# Altium schematic sheet main.SchDoc
size A3
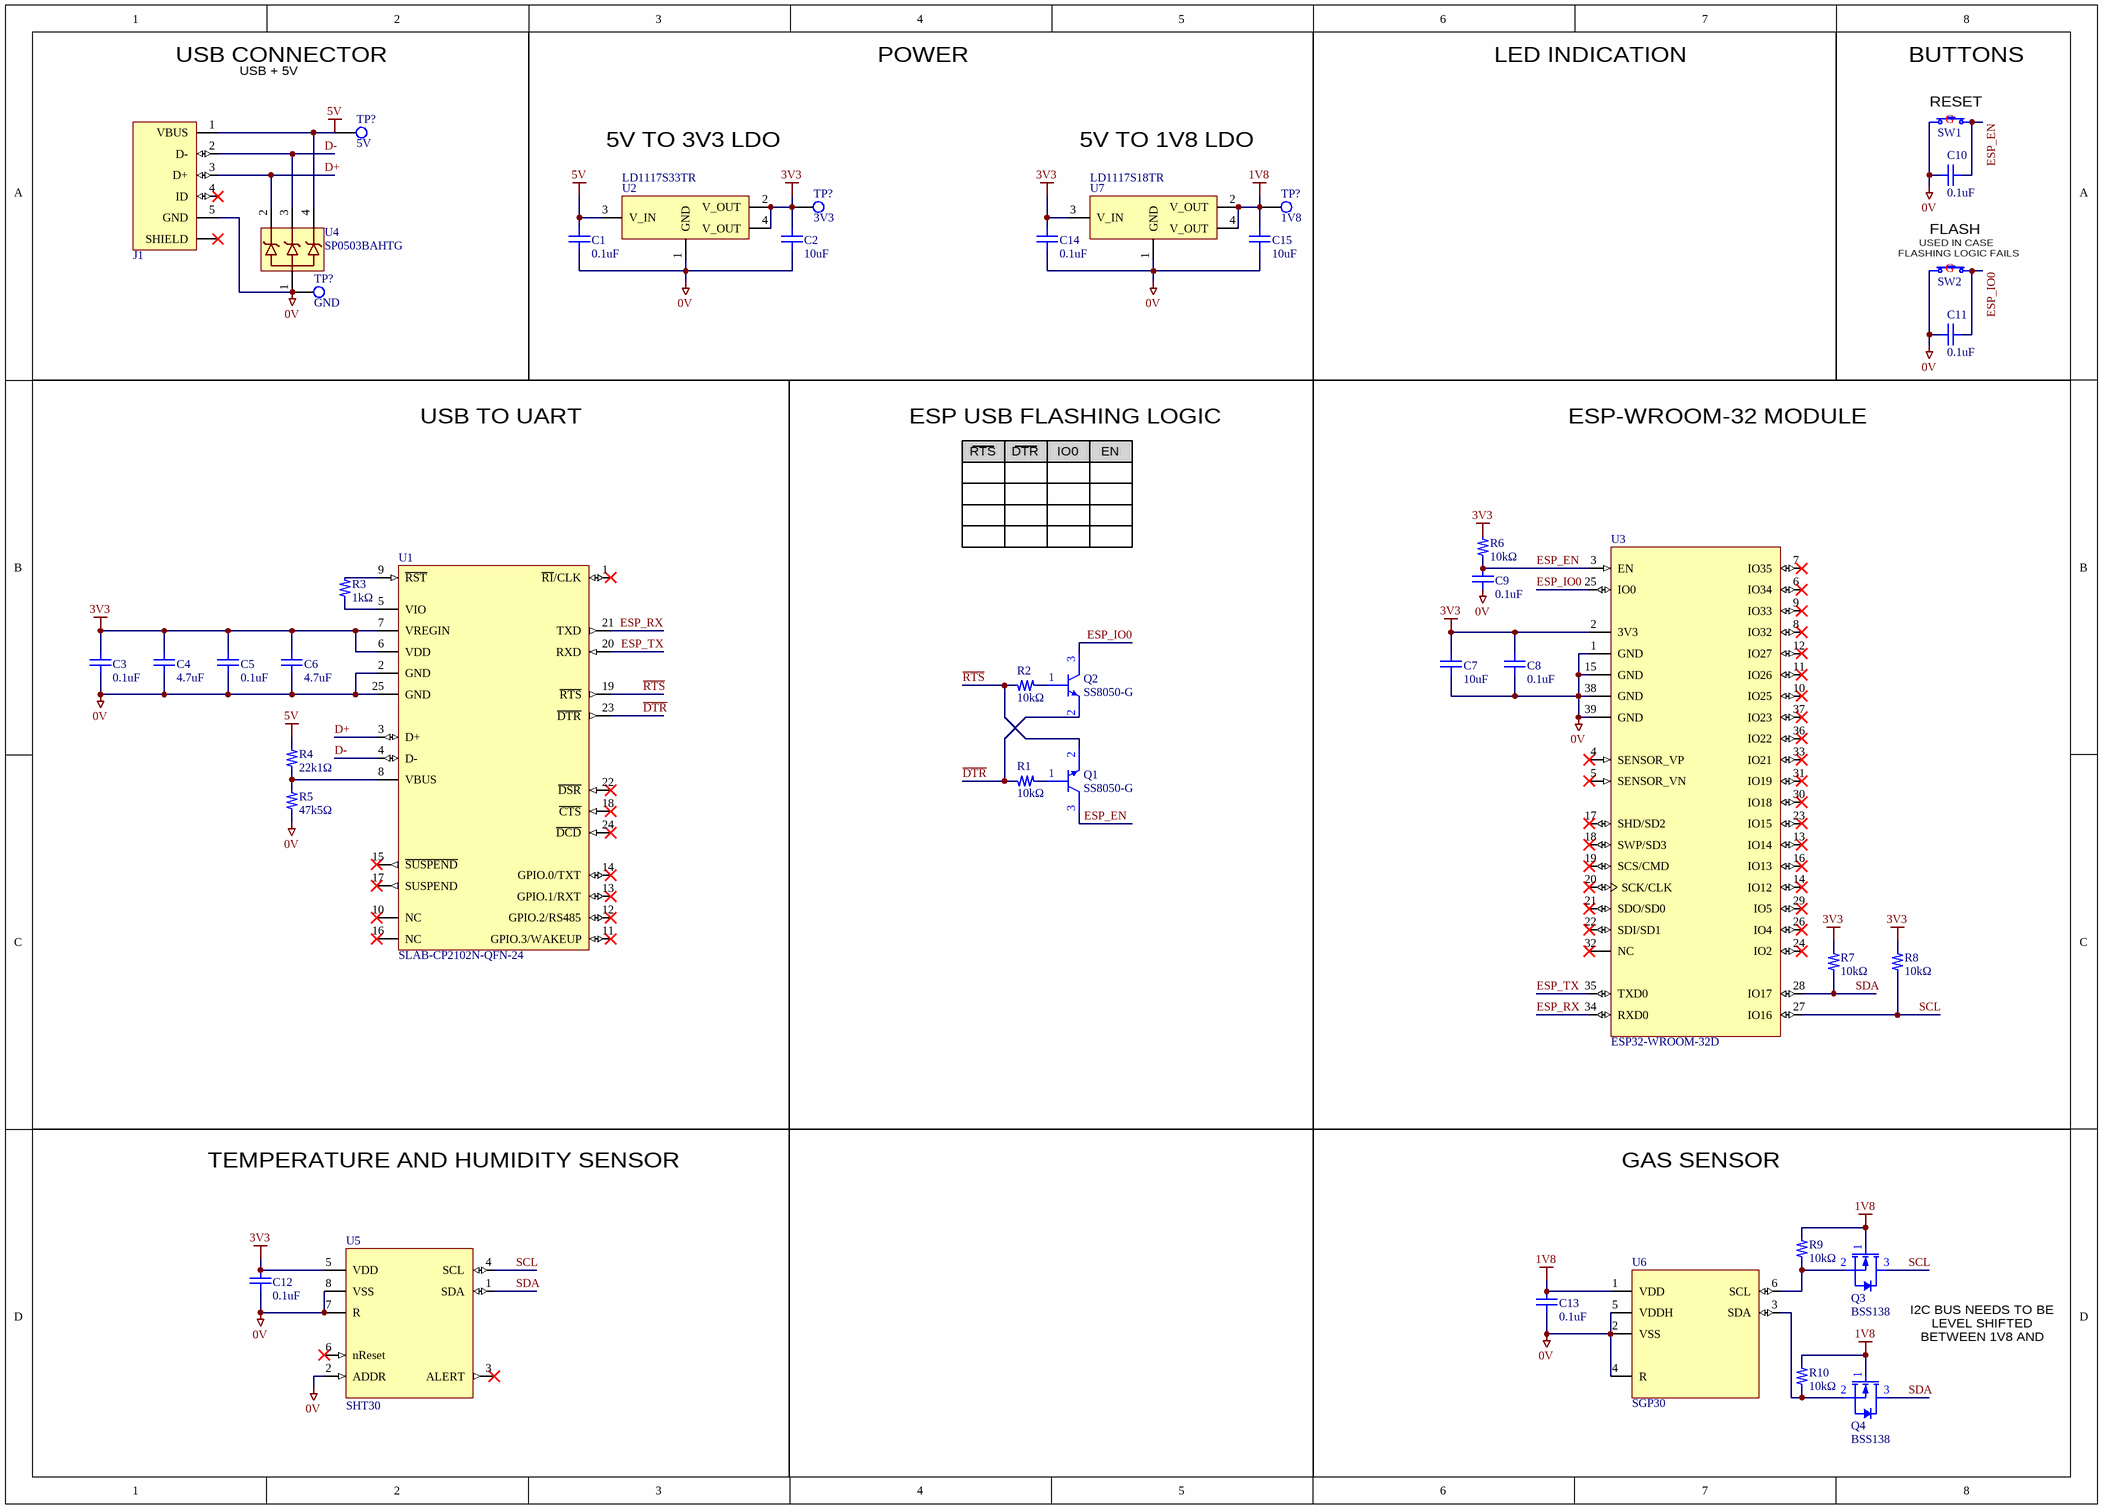
[diagram p0: main.SchDoc]

## Parts
(Parts that share a designator on the sheet are numbered #1, #2 ... from top to bottom, then left to right.)
C1  0.1uF  [CAP_0603]
C2  10uF  [CAP_0603]
C3  0.1uF  [CAP_0603]
C4  4.7uF  [CAP_0603]
C5  0.1uF  [CAP_0603]
C6  4.7uF  [CAP_0603]
C7  10uF  [CAP_0603]
C8  0.1uF  [CAP_0603]
C9  0.1uF  [CAP_0603]
C10  0.1uF  [CAP_0603]
C11  0.1uF  [CAP_0603]
C12  0.1uF  [CAP_0603]
C13  0.1uF  [CAP_0603]
C14  0.1uF  [CAP_0603]
C15  10uF  [CAP_0603]
J1  UJ2-MIBH2-4-SMT-TR  [CON_USB_MICRO_DRILL]  (value not drawn)
Q1  SS8050-G  [SOT-23]
Q2  SS8050-G  [SOT-23]
Q3  BSS138  [SOT-23]
Q4  BSS138  [SOT-23]
R1  10kΩ  [RES_0603_HD]
R2  10kΩ  [RES_0603_HD]
R3  1kΩ  [RES_0603_HD]
R4  22k1Ω  [RES_0603_HD]
R5  47k5Ω  [RES_0603_HD]
R6  10kΩ  [RES_0603_HD]
R7  10kΩ  [RES_0603_HD]
R8  10kΩ  [RES_0603_HD]
R9  10kΩ  [RES_0603_HD]
R10  10kΩ  [RES_0603_HD]
SW1  SW_PUSH_GENERIC  (value not drawn)
SW2  SW_PUSH_GENERIC  (value not drawn)
TP?#1  5V  [UTIL_Test_Point_3mm_1mmHole]
TP?#2  3V3  [UTIL_Test_Point_3mm_1mmHole]
TP?#3  1V8  [UTIL_Test_Point_3mm_1mmHole]
TP?#4  GND  [UTIL_Test_Point_3mm_1mmHole]
U1  SLAB-CP2102N-QFN-24  [SLAB-QFN-24-2550x2550TP_A_V]
U2  LD1117S33TR  [SOT-223]
U3  ESP32-WROOM-32D  [ESP_WROOM_32D]
U4  SP0503BAHTG  [SOT-143]
U5  SHT30  [SHT3x_8-VFDFN_Exposed_Pad]
U6  SGP30  [SGP30]
U7  LD1117S18TR  [SOT-223]

## Nets
0V: C1.1 C2.1 C3.1 C4.1 C5.1 C6.1 C7.1 C8.1 C9.1 C10.1 C11.1 C12.1 C13.1 C14.1 C15.1 J1.5(GND) R5.1 SW1.1 SW2.1 TP?#4.1(D) U1.2(GND) U1.25(GND) U2.1(GND) U3.1(GND) U3.15(GND) U3.38(GND) U3.39(GND) U4.1 U5.2(ADDR) U5.7(R) U5.8(VSS) U6.2(VSS) U6.4(R) U6.5(VDDH) U7.1(GND)
1V8: C13.2 C15.2 Q3.1(G) Q4.1(G) R9.2 R10.2 TP?#3.1(D) U6.1(VDD) U7.2(V_OUT) U7.4(V_OUT)
3V3: C2.2 C3.2 C4.2 C5.2 C6.2 C7.2 C8.2 C12.2 C14.2 R6.2 R7.2 R8.2 TP?#2.1(D) U1.6(VDD) U1.7(VREGIN) U2.2(V_OUT) U2.4(V_OUT) U3.2(3V3) U5.5(VDD) U7.3(V_IN)
5V: C1.2 J1.1(VBUS) R4.2 TP?#1.1(D) U2.3(V_IN) U4.4
D+: J1.3(D+) U1.3(D+) U4.2
D-: J1.2(D-) U1.4(D-) U4.3
~{DTR}: Q2.2(E) R1.1 U1.23(~{DTR})
ESP_EN: C9.2 C10.2 Q1.3(C) R6.1 SW1.2 U3.3(EN)
ESP_IO0: C11.2 Q2.3(C) SW2.2 U3.25(IO0)
ESP_RX: U1.21(TXD) U3.34(RXD0)
ESP_TX: U1.20(RXD) U3.35(TXD0)
~{RTS}: Q1.2(E) R2.1 U1.19(~{RTS})
SCL: Q3.3(D) R8.1 U3.27(IO16) U5.4(SCL)
SDA: Q4.3(D) R7.1 U3.28(IO17) U5.1(SDA)
NetQ1_1: Q1.1(B) R1.2
NetQ2_1: Q2.1(B) R2.2
NetQ3_2: Q3.2(S) R9.1 U6.6(SCL)
NetQ4_2: Q4.2(S) R10.1 U6.3(SDA)
NetR3_1: R3.1 U1.5(VIO)
NetR3_2: R3.2 U1.9(~{RST})
NetR4_1: R4.1 R5.2 U1.8(VBUS)

Not connected (* = marked no-connect by the designer): J1 4(ID)* SH(SHIELD)*; U1 1(~{RI}/CLK)* 10(NC)* 11(GPIO.3/WAKEUP)* 12(GPIO.2/RS485)* 13(GPIO.1/RXT)* 14(GPIO.0/TXT)* 15(~{SUSPEND})* 16(NC)* 17(SUSPEND)* 18(~{CTS})* 22(~{DSR})* 24(~{DCD})*; U3 4(SENSOR_VP)* 5(SENSOR_VN)* 6(IO34)* 7(IO35)* 8(IO32)* 9(IO33)* 10(IO25)* 11(IO26)* 12(IO27)* 13(IO14)* 14(IO12)* 16(IO13)* 17(SHD/SD2)* 18(SWP/SD3)* 19(SCS/CMD)* 20(SCK/CLK)* 21(SDO/SD0)* 22(SDI/SD1)* 23(IO15)* 24(IO2)* 26(IO4)* 29(IO5)* 30(IO18)* 31(IO19)* 32(NC)* 33(IO21)* 36(IO22)* 37(IO23)*; U5 3(ALERT)* 6(nReset)*

## Notes on the sheet
- USB CONNECTOR
- USB + 5V
- POWER
- LED INDICATION
- (near SW1) BUTTONS
- (near SW1) RESET
- (near U2) 5V TO 3V3 LDO
- 5V TO 1V8 LDO
- (near SW2) USED IN CASE
- FLASH
- (near SW2) FLASHING LOGIC FAILS
- USB TO UART
- ESP USB FLASHING LOGIC
- RTS
- DTR
- IO0
- EN
- ESP-WROOM-32 MODULE
- TEMPERATURE AND HUMIDITY SENSOR
- GAS SENSOR
- I2C BUS NEEDS TO BE LEVEL SHIFTED BETWEEN 1V8 AND 3V3.
- (in symbol SW_PUSH_GENERIC) G

## Library data of the parts
C1 C3 C5 C8-C14 = CAP_0.1uF_16V_0603: CAP CER 0.1UF 16V X7R 0603; Manufacturer: Murata; Manufacturer Part Number: GCM188R71C104KA37D; Tolerance: 10%; Capacitance: 100nF; Supplier 1: Digi-Key; Stock 1: 40000; Pricing 1: 1=0.1, 10=0.076, 100=0.0341, 500=0.0243, 1000=0.0191 (USD); Mount: Surface Mount; Case/Package: 0603; Case Code (Metric): 1608; Case Code (Imperial): 0603; Min Operating Temperature: -55°C; Max Operating Temperature: 125°C; Packaging: Tape and Reel; Package Quantity: 4000; Voltage Rating: 16V; Voltage Rating (DC): 16V; Dielectric: X7R; Termination: SMD/SMT; Voltage: 16V; Length: 1.6mm; Height: 0.8mm; Width: 0.031inch; Thickness: 0.035inch; Depth: 0.8mm; Ratings: AEC-Q200; Radiation Hardening: No; REACH SVHC: No SVHC; Lead Free: Lead Free; Supplier Part Number 1: 490-4774-1-ND
C2 C7 C15 = CAP_10uF_16V_0603: 10µF ±20% 16V X5R Ceramic Capacitor -55°C ~ 85°C Surface Mount, MLCC 0603 (1608 Metric) 0.063" L x 0.031" W (1.60mm x 0.80mm); Manufacturer: Murata; Manufacturer Part Number: GRM188R61C106MA73D; Supplier 1: Digi-Key; Stock 1: 0; Pricing 1: 1=0.45, 10=0.311, 100=0.1867, 500=0.14, 1000=0.1183 (USD); Mount: Surface Mount; Case/Package: 0603; Case Code (Metric): 1608; Case Code (Imperial): 0603; Min Operating Temperature: -55°C; Max Operating Temperature: 85°C; Package Quantity: 4000; Packaging: Tape and Reel; Capacitance: 10uF; Voltage Rating: 16V; Tolerance: 20%; Dielectric: X5R; Voltage: 16V; Voltage Rating (DC): 16V; Length: 1.6mm; Height: 0.8mm; Width: 0.031inch; Thickness: 0.031inch; Depth: 0.8mm; REACH SVHC: No SVHC; Lead Free: Lead Free
C4 C6 = CAP_4.7uF_16V_0603: Cap Ceramic 4.7uF 16V X5R 10% SMD 0603 85C Paper T/R; Manufacturer: Samsung; Manufacturer Part Number: CL10A475KO8NNNC; Supplier 1: Digi-Key; Stock 1: 40000; Pricing 1: 1=0.3, 10=0.203, 100=0.1148, 500=0.081, 1000=0.0709 (USD); Mount: Surface Mount; Case/Package: 0603; Case Code (Metric): 1608; Case Code (Imperial): 0603; Material: Ceramic; Contact Plating: Tin; Min Operating Temperature: -55°C; Max Operating Temperature: 85°C; Tolerance: 10%; Packaging: Tape and Reel; Package Quantity: 1; Capacitance: 4.7uF; Voltage Rating: 16V; Dielectric: X5R; Voltage: 16V; Length: 1.6mm; Height: 0.8mm; Width: 0.031inch; Thickness: 0.035inch; Depth: 0.8mm; Radiation Hardening: No; Supplier Part Number 1: 1276-1784-1-ND
J1 = CON_USB_MICRO_DRILL: UJ2-MIBH2-4-SMT-TR MICRO B USB JACK; Manufacturer: CUI; Supplier 1: Digi-Key; Manufacturer Part Number: UJ2-MIBH2-4-SMT-TR; Stock 1: 5971; Pricing 1: 1=1.02, 10=0.898, 25=0.8448, 50=0.8096, 100=0.7744, 250=0.704, 500=0.6336 (USD); Number of Pins: 5; Supplier Part Number 1: 102-4007-1-ND
Q1 Q2 = NPN_1.5A_SOT23: S8050-G NPN1.5A 40V SOT-23 R; Manufacturer: Comchip; Max Collector Current: 1.5A; Collector Emitter Voltage (VCEO): 400mV; Max Power Dissipation: 300mW; Transition Frequency: 100MHz; Collector Emitter Breakdown Voltage: 25V; Supplier 1: Digi-Key; Manufacturer Part Number: SS8050-G; Stock 1: 0; Pricing 1: 1=0.24, 10=0.219, 25=0.1576, 100=0.1227, 250=0.0771, 500=0.0657, 1000=0.0447 (USD); Mount: Surface Mount; Case/Package: TO-236-3; Packaging: Tape and Reel; Max Breakdown Voltage: 25V; Supplier Part Number 1: 641-1790-1-ND
Q3 Q4 = BSS138_N_MOSFET_SOT-23: MOSFET N-CH 50V 220MA SOT-23; Manufacturer: ON Semiconductor / Fairchild; Rds On Max: 3.5R; Input Capacitance: 27pF; Nominal Vgs: 1.3V; Number of Elements: 1; Max Power Dissipation: 360mW; Rise Time: 9ns; Turn-Off Delay Time: 20ns; Turn-On Delay Time: 2.5ns; Element Configuration: Single; Gate to Source Voltage (Vgs): 20V; On-State Resistance: 6R; Supplier 1: Digi-Key; Manufacturer Part Number: BSS138; Stock 1: 1411776; Pricing 1: 1=0.32, 10=0.292, 100=0.1633, 500=0.0875, 1000=0.0595 (USD); Mount: Surface Mount; Case/Package: SOT-23; Number of Pins: 3; Weight: 0.03g; Contact Plating: Matte,Tin; Min Operating Temperature: -55°C; Max Operating Temperature: 150°C; Packaging: Tape and Reel; Package Quantity: 1; Dual Supply Voltage: 50V; Drain to Source Voltage (Vdss): 50V; Continuous Drain Current (ID): 220mA; Drain to Source Breakdown Voltage: 50V; Fall Time: 9ns; Drain to Source Resistance: 3.5R; Power Dissipation: 360mW; Threshold Voltage: 1.3V; Termination: SMD/SMT; Voltage Rating (DC): 50V; Current Rating: 220mA; Length: 2.92mm; Height: 0.93mm; Width: 1.3mm; Radiation Hardening: No; REACH SVHC: No SVHC; Lead Free: Lead Free; Supplier Part Number 1: BSS138CT-ND
R1 R2 R6-R10 = RES_10k_0603: Res Thin Film 0603 10K Ohm 1% 1/8W 100ppm/C Molded SMD SMD Paper T/R; Manufacturer: Stackpole Electronics; Manufacturer Part Number: RNCP0603FTD10K0; Resistance: 10kR; Max Power Dissipation: 125mW; Temperature Coefficient: 100ppm/°C; Supplier 1: Digi-Key; Stock 1: 72973; Pricing 1: 1=0.1, 10=0.067, 100=0.0273, 1000=0.0122, 2500=0.0106 (USD); Mount: Surface Mount; Case/Package: 0603; Case Code (Metric): 1608; Case Code (Imperial): 0603; Contact Plating: Matte,Tin; Min Operating Temperature: -55°C; Max Operating Temperature: 155°C; Packaging: Tape and Reel; Tolerance: 1%; Composition: Thin Film; Number of Terminations: 2; Features: Anti-Sulfur,Moisture Resistant; Length: 0.059inch; Height: 0.02inch; Width: 0.031inch; Radiation Hardening: No; Lead Free: Lead Free; Supplier Part Number 1: RNCP0603FTD10K0CT-ND
R3 = RES_1k_0603: RMCF Series 1 kOhms ±5% 0603 ±200 ppm/°C SMT Thick Film Chip Resistor; Manufacturer: Stackpole Electronics; Manufacturer Part Number: RMCF0603JJ1K00; Resistance: 1kR; Power Rating: 100mW; Supplier 1: Digi-Key; Stock 1: 6000; Pricing 1: 1=0.1, 10=0.016, 100=0.0064, 1000=0.0029, 2500=0.0025, 5000=0.0021 (USD); Mount: Surface Mount; Case/Package: 0603; Case Code (Metric): 1608; Case Code (Imperial): 0603; Min Operating Temperature: -55°C; Max Operating Temperature: 155°C; Tolerance: 5%; Packaging: Tape and Reel; Composition: Thick Film; Number of Terminations: 2; Max Power Dissipation: 100mW; Temperature Coefficient: 200ppm/°C; Features: Automotive AEC-Q200; Length: 0.061inch; Height: 0.022inch; Width: 0.031inch; Lead Free: Lead Free; Supplier Part Number 1: RMCF0603JJ1K00CT-ND
R4 = RES_22k1_0603: RES SMD 22.1K OHM 1% 1/8W 0603; Manufacturer: Stackpole Electronics; Manufacturer Part Number: RNCP0603FTD22K1; Resistance: 22.1kR; Max Power Dissipation: 125mW; Temperature Coefficient: 100ppm/°C; Supplier 1: Digi-Key; Stock 1: 1191; Pricing 1: 1=0.1, 10=0.067, 100=0.0273, 1000=0.0122, 2500=0.0106 (USD); Mount: Surface Mount; Case/Package: 0603; Case Code (Metric): 1608; Case Code (Imperial): 0603; Min Operating Temperature: -55°C; Max Operating Temperature: 155°C; Tolerance: 1%; Packaging: Tape and Reel; Composition: Thin Film; Number of Terminations: 2; Features: Anti-Sulfur,Moisture Resistant; Length: 0.059inch; Height: 0.02inch; Width: 0.031inch; Supplier Part Number 1: RNCP0603FTD22K1CT-ND
R5 = RES_47k5_0603: Res Thick Film 0603 47.5K Ohm 1% 1/10W 100ppm/C Molded SMD SMD Paper T/R; Manufacturer: Stackpole Electronics; Manufacturer Part Number: RMCF0603FG47K5; Resistance: 47.5kR; Max Power Dissipation: 100mW; Temperature Coefficient: 100ppm/°C; Supplier 1: Digi-Key; Stock 1: 5202; Pricing 1: 1=0.1, 10=0.018, 100=0.0071, 1000=0.0032, 2500=0.0028, 5000=0.0023 (USD); Mount: Surface Mount; Case/Package: 0603; Case Code (Metric): 1608; Case Code (Imperial): 0603; Contact Plating: Matte,Tin; Min Operating Temperature: -55°C; Max Operating Temperature: 155°C; Packaging: Tape and Reel; Tolerance: 1%; Package Quantity: 1; Composition: Thick Film; Number of Terminations: 2; Features: Automotive AEC-Q200; Length: 0.061inch; Height: 0.022inch; Width: 0.031inch; Radiation Hardening: No; Supplier Part Number 1: RMCF0603FG47K5CT-ND
TP?#1-TP?#4 = UTIL_Test_Point: Test Point
U2 = LDO_3V3_LD1117S33TR: STMICROELECTRONICS         LD1117S33TR            Fixed LDO Voltage Regulator, 4.75V to 15V, 1.1V Dropout, 3.3Vout, 800mAout, SOT-223-3; Number of Outputs: 1; Max Output Current: 1.3A; Output Voltage: 3.3V; Max Power Dissipation: 12W; Output Current: 800mA; Input Bias Current: 5mA; Quiescent Current: 10mA; Polarity: Positive; Accuracy: 1%; Supplier 1: Digi-Key; Manufacturer: STMicroelectronics; Manufacturer Part Number: LD1117S33TR; Stock 1: 10; Pricing 1: 1=0.42, 10=0.361, 100=0.2697, 500=0.2119, 1000=0.1637 (USD); Mount: Surface Mount; Case/Package: SOT-223; Number of Pins: 4; Weight: 0.01lb; Contact Plating: Tin,Matte; Min Operating Temperature: 0°C; Max Operating Temperature: 125°C; Packaging: Tape and Reel; Dropout Voltage: 1.1V; Max Input Voltage: 15V; Min Input Voltage: 4.75V; Max Supply Voltage: 15V; Min Supply Voltage: 4.75V; Package Quantity: 1; Nominal Output Voltage: 3.3V; Number of Regulators: 1; Power Dissipation: 12W; Min Output Voltage: 3.3V; Max Output Voltage: 3.3V; Termination: SMD/SMT; Voltage: 3.3V; Output Voltage Accuracy: 1%; Output Type: Fixed; Length: 6.5mm; Height: 1.8mm; Width: 3.5mm; Radiation Hardening: No; REACH SVHC: No SVHC; Lead Free: Lead Free; ComponentLink1URL: https://datasheet.ciiva.com/19478/1390240-19478097.pdf; ComponentLink1Description: https://datasheet.ciiva.com/19478/1390240-19478097.pdf; ComponentLink2URL: https://datasheet.ciiva.com/1511/1776449-1511573.pdf; ComponentLink2Description: https://datasheet.ciiva.com/1511/1776449-1511573.pdf; ComponentLink3URL: https://datasheet.ciiva.com/2041/cd00000544-2041941.pdf; ComponentLink3Description: https://datasheet.ciiva.com/2041/cd00000544-2041941.pdf; ComponentLink4URL: https://datasheet.ciiva.com/2041/cd00000544-2041942.pdf; ComponentLink4Description: https://datasheet.ciiva.com/2041/cd00000544-2041942.pdf; ComponentLink5URL: https://datasheet.ciiva.com/2041/cd00000544-2041943.pdf; ComponentLink5Description: https://datasheet.ciiva.com/2041/cd00000544-2041943.pdf; ComponentLink6URL: https://datasheet.ciiva.com/16396/cd00000544-16396459.pdf; ComponentLink6Description: https://datasheet.ciiva.com/16396/cd00000544-16396459.pdf; ComponentLink7URL: https://datasheet.ciiva.com/7992/1776449-7992621.pdf; ComponentLink7Description: https://datasheet.ciiva.com/7992/1776449-7992621.pdf; ComponentLink8URL: https://datasheet.ciiva.com/28652/1776449-28652462.pdf; ComponentLink8Description: https://datasheet.ciiva.com/28652/1776449-28652462.pdf; Supplier Part Number 1: 497-1242-1-ND
U3 = ESP-WROOM-32D: Manufacturer: Espressif Systems; Supplier 1: Digi-Key; Manufacturer Part Number: ESP32-WROOM-32D; Stock 1: 0; Supplier Part Number 1: 1904-1023-1-ND
U4 = DIODE_TVSx3: SP0503BAHTG TVS DIODE 5.5VWM 8.5VC SOT143; Manufacturer: Littelfuse; Operating Supply Voltage: 5.5V; Element Configuration: Common Anode; Direction: Unidirectional; Capacitance: 30pF; Number of Channels: 3; Clamping Voltage: 8.5V; Power Line Protection: No; Polarity: Unidirectional,Bidirectional; Max Power Dissipation: 225mW; ESD Protection: Yes; Max Reverse Leakage Current: 100nA; Voltage Rating (DC): 5V; Diode Type: Avalanche; Supplier 1: Digi-Key; Manufacturer Part Number: SP0503BAHTG; Stock 1: 123231; Pricing 1: 1=0.92, 10=0.806, 25=0.714, 100=0.622, 250=0.5414, 500=0.4607, 1000=0.3686 (USD); Mount: Surface Mount; Case/Package: SOT-143; Number of Pins: 4; Min Operating Temperature: -40°C; Max Operating Temperature: 85°C; Packaging: Tape and Reel; Number of Unidirectional Channels: 3; Reverse Standoff Voltage: 5.5V; Breakdown Voltage: 5.5V; Termination: SMD/SMT; Working Voltage: 5.5V; Peak Pulse Power: 225mW; Leakage Current: 100nA; Number of Elements: 3; Power Dissipation: 225mW; Composition: Zener; Length: 3.04mm; Height: 1.05mm; Width: 1.4mm; Depth: 1.4mm; Radiation Hardening: No; REACH SVHC: No SVHC; Lead Free: Lead Free; ComponentLink1URL: https://datasheet.ciiva.com/15143/getdatasheetpartid-116020-15143550.pdf; ComponentLink1Description: https://datasheet.ciiva.com/15143/getdatasheetpartid-116020-15143550.pdf; ComponentLink2URL: https://datasheet.ciiva.com/332/sp05xxba-332550.pdf; ComponentLink2Description: https://datasheet.ciiva.com/332/sp05xxba-332550.pdf; ComponentLink3URL: https://datasheet.ciiva.com/8062/littefuse-spa-sp050x-8062422.pdf; ComponentLink3Description: https://datasheet.ciiva.com/8062/littefuse-spa-sp050x-8062422.pdf; ComponentLink4URL: https://datasheet.ciiva.com/22697/1911798-22697942.pdf; ComponentLink4Description: https://datasheet.ciiva.com/22697/1911798-22697942.pdf; ComponentLink5URL: https://datasheet.ciiva.com/332/sp05xxba-332551.pdf; ComponentLink5Description: https://datasheet.ciiva.com/332/sp05xxba-332551.pdf; ComponentLink6URL: https://datasheet.ciiva.com/16449/sp05xxba-16449463.pdf; ComponentLink6Description: https://datasheet.ciiva.com/16449/sp05xxba-16449463.pdf; ComponentLink7URL: https://datasheet.ciiva.com/332/sp05xxba-332552.pdf; ComponentLink7Description: https://datasheet.ciiva.com/332/sp05xxba-332552.pdf; ComponentLink8URL: https://datasheet.ciiva.com/4509/sp05x-leadfree-4509162.pdf; ComponentLink8Description: https://datasheet.ciiva.com/4509/sp05x-leadfree-4509162.pdf; ComponentLink9URL: https://datasheet.ciiva.com/7650/526672-7650894.pdf; ComponentLink9Description: https://datasheet.ciiva.com/7650/526672-7650894.pdf; Supplier Part Number 1: F2715CT-ND
U5 = SEN_SHT30-DIS-B: Manufacturer: Sensirion; Response Time: 8s; Min Supply Voltage: 2.4V; Max Supply Voltage: 5.5V; Capacitance: 100nF; Accuracy: 3%; Sensor Type: Temperature; Output Type: I2C; Supplier 1: Digi-Key; Manufacturer Part Number: SHT30-DIS-B; Stock 1: 5931; Pricing 1: 1=3.96, 5=3.496, 10=3.089, 25=2.506, 50=2.2144, 100=2.1562, 500=1.8065, 1000=1.69 (USD); Mount: Surface Mount; Min Operating Temperature: -40°C; Max Operating Temperature: 125°C; REACH SVHC: Unknown; Lead Free: Lead Free; Supplier Part Number 1: 1649-1009-1-ND
U6 = SEN_SGP30-2.5K: Air quality sensor; Manufacturer: Sensirion; Manufacturer Part Number: 1-101646-01; Supplier 1: Digi-Key; Stock 1: 2448; Pricing 1: 1=13.7, 5=12.016, 10=10.814, 25=9.6128, 50=8.8916, 100=7.6901, 500=7.2095, 1000=6.7288 (USD); Supplier Part Number 1: 1649-1084-1-ND
U7 = LDO_1V8_LD1117S18TR_SOT-223: Manufacturer: STMicroelectronics; Max Power Dissipation: 12W; Number of Outputs: 1; Max Input Voltage: 15V; Max Output Current: 1.3A; Output Voltage: 1.8V; Output Current: 950mA; Dropout Voltage: 1.1V; Input Bias Current: 5mA; Quiescent Current: 10mA; Polarity: Positive; Accuracy: 1%; Output Type: Fixed; Supplier 1: Digi-Key; Manufacturer Part Number: LD1117S18TR; Stock 1: 6805; Pricing 1: 1=0.6, 10=0.51, 100=0.3807, 500=0.2991, 1000=0.2311 (USD); Mount: Surface Mount; Case/Package: SOT-223; Number of Pins: 4; Min Operating Temperature: 0°C; Max Operating Temperature: 125°C; Packaging: Tape and Reel; Package Quantity: 1; Number of Regulators: 1; Power Dissipation: 12W; Min Output Voltage: 1.8V; Nominal Output Voltage: 1.8V; Output Voltage Accuracy: 1%; Length: 6.5mm; Height: 1.8mm; Width: 3.5mm; Radiation Hardening: No; REACH SVHC: No SVHC; Lead Free: Lead Free; Supplier Part Number 1: 497-7308-1-ND